# Altium schematic sheet [06] Data IN_OUT.SchDoc: DATA INPUT OUTPUT
size A4
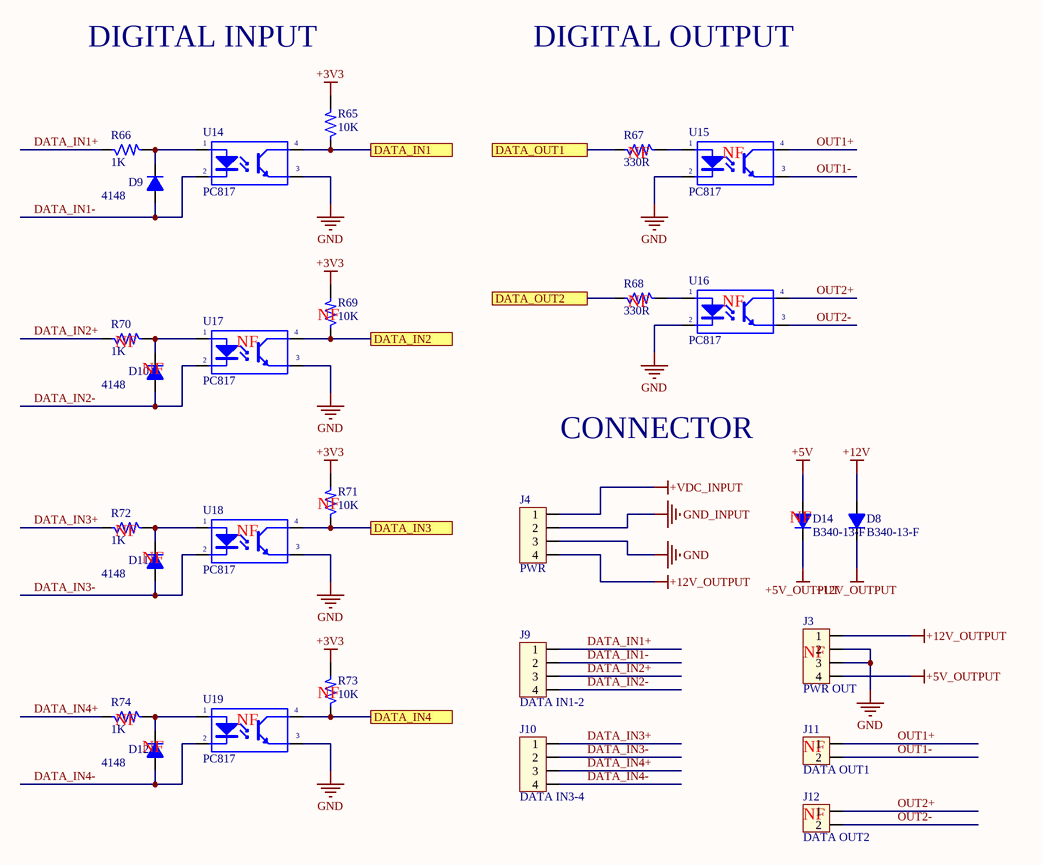
[diagram p0: [06] Data IN_OUT.SchDoc]

## Parts
D8  B340-13-F  [DO-214AB SMA]
D9  4148  [DO-4148 SMD]
D10  4148  [DO-4148 SMD]
D11  4148  [DO-4148 SMD]
D12  4148  [DO-4148 SMD]
D14  B340-13-F  [DO-214AB SMA]
J3  PWR OUT  [CON_2.54mm_4]
J4  PWR  [Hed4V_3.96]
J9  DATA IN1-2  [CON_2.54mm_4]
J10  DATA IN3-4  [CON_2.54mm_4]
J11  DATA OUT1  [CON_2.54mm_2]
J12  DATA OUT2  [CON_2.54mm_2]
R65  10K  [R0603 -SMT]
R66  1K  [R0603 -SMT]
R67  330R  [R0603 -SMT]
R68  330R  [R0603 -SMT]
R69  10K  [R0603 -SMT]
R70  1K  [R0603 -SMT]
R71  10K  [R0603 -SMT]
R72  1K  [R0603 -SMT]
R73  10K  [R0603 -SMT]
R74  1K  [R0603 -SMT]
U14  PC817  [DIP4/W0.3]
U15  PC817  [DIP4/W0.3]
U16  PC817  [DIP4/W0.3]
U17  PC817  [DIP4/W0.3]
U18  PC817  [DIP4/W0.3]
U19  PC817  [DIP4/W0.3]

## Ports
DATA_IN1, DATA_IN2, DATA_IN3, DATA_IN4, DATA_OUT1, DATA_OUT2

## Nets
+3V3: R65.2 R69.2 R71.2 R73.2
+5V: D14.1(A)
+5V_OUTPUT: D14.2(K) J3.4
+12V: D8.1(A)
+12V_OUTPUT: D8.2(K) J3.1 J4.4
+VDC_INPUT: J4.1
GND: J3.2 J3.3 J4.3 U14.3(E) U15.2(K) U16.2(K) U17.3(E) U18.3(E) U19.3(E)
GND_INPUT: J4.2
DATA_IN1: R65.1 U14.4(C) ; port DATA_IN1
DATA_IN1+: J9.1 R66.1
DATA_IN1-: D9.1(A) J9.2 U14.2(K)
DATA_IN2: R69.1 U17.4(C) ; port DATA_IN2
DATA_IN2+: J9.3 R70.1
DATA_IN2-: D10.1(A) J9.4 U17.2(K)
DATA_IN3: R71.1 U18.4(C) ; port DATA_IN3
DATA_IN3+: J10.1 R72.1
DATA_IN3-: D11.1(A) J10.2 U18.2(K)
DATA_IN4: R73.1 U19.4(C) ; port DATA_IN4
DATA_IN4+: J10.3 R74.1
DATA_IN4-: D12.1(A) J10.4 U19.2(K)
DATA_OUT1: R67.1 ; port DATA_OUT1
DATA_OUT2: R68.1 ; port DATA_OUT2
OUT1+: J11.1 U15.4(C)
OUT1-: J11.2 U15.3(E)
OUT2+: J12.1 U16.4(C)
OUT2-: J12.2 U16.3(E)
NetD9_2: D9.2(K) R66.2 U14.1(A)
NetD10_2: D10.2(K) R70.2 U17.1(A)
NetD11_2: D11.2(K) R72.2 U18.1(A)
NetD12_2: D12.2(K) R74.2 U19.1(A)
NetR67_2: R67.2 U15.1(A)
NetR68_2: R68.2 U16.1(A)

## Notes on the sheet
- DIGITAL INPUT
- DIGITAL OUTPUT
- (near R67) NF
- (near U15) NF
- (near R68) NF
- (near U16) NF
- (near R70) NF
- (near D10) NF
- (near U17) NF
- (near R69) NF
- CONNECTOR
- (near R71) NF
- (near R72) NF
- (near D11) NF
- (near U18) NF
- (near D14) NF
- (near R73) NF
- (near J3) NF
- (near R74) NF
- (near D12) NF
- (near U19) NF
- (near J11) NF
- (near J12) NF
- Title
- Size:
- Date:
- A4
- Number:
- Time:
- Revision:
- Sheet
- of
- File:

## Library data of the parts
D8-D12 D14 = D1A: Diode 1A; Value: 1N4007
J3 J9 J10 = Con4: Connector 4; Value: Connector 4
J4 = Hed4: Header 4 (Green); Value: Header 4
J11 J12 = Con2: Connector 2; Value: Connector 2
R65 R67-R69 R71 R73 = RM: Resistor SMD; Value: 1K
R66 R70 R72 R74 = RM: Resistor SMD; Value: 1K
U14-U19 = PC817: Single Opto; Value: PC817